# EAGLE design RGBKeyboard (EAGLE 9.3.0)

## Sheet 1 of 2
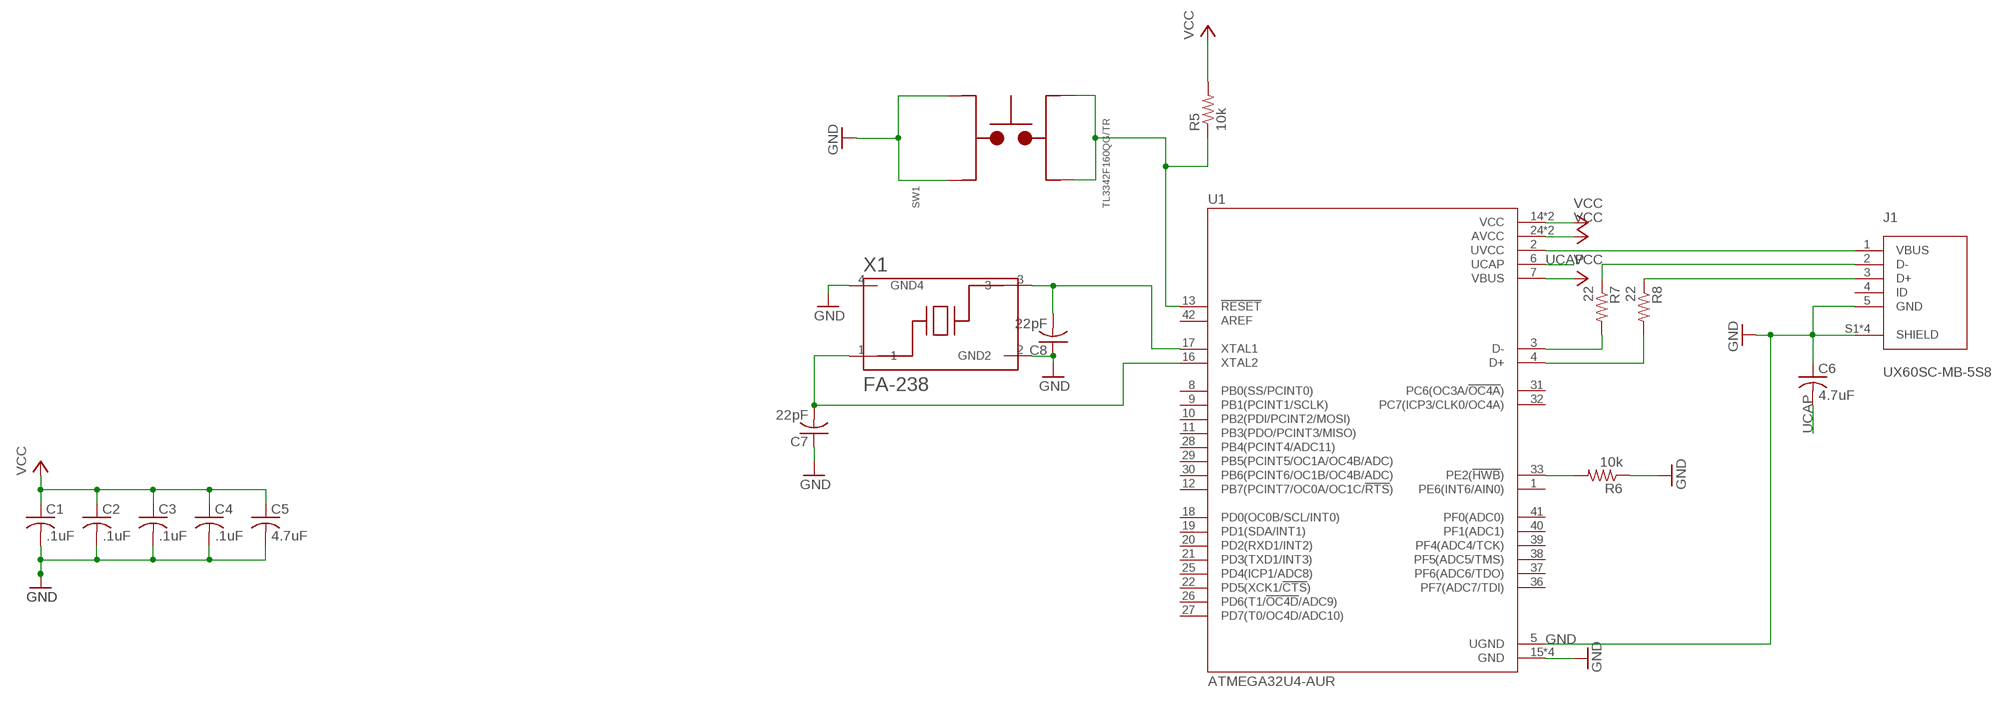
[diagram p0: schematic, sheet 1]

### Parts
C1  .1uF  C-USC0805  [C0805]
C2  .1uF  C-USC0805  [C0805]
C3  .1uF  C-USC0805  [C0805]
C4  .1uF  C-USC0805  [C0805]
C5  4.7uF  C-USC0805  [C0805]
C6  4.7uF  C-USC0805  [C0805]
C7  22pF  C-USC0805  [C0805]
C8  22pF  C-USC0805  [C0805]
J1  UX60SC-MB-5S8  [HIROSE_UX60SC-MB-5S8]
R5  10k  R-US_R0805  [R0805]
R6  10k  R-US_R0805  [R0805]
R7  22  R-US_R0805  [R0805]
R8  22  R-US_R0805  [R0805]
SW1  TL3342F160QG/TR  [SW_TL3342F160QG/TR]
U1  ATMEGA32U4-AUR  [QFP80P1200X1200X120-44N]
X1  FA-238  [OSCCC320X250X70-4N]

### Nets
GND: C1.2 C2.2 C3.2 C4.2 C5.2 C6.1 C7.1 C8.1 J1.5(GND) J1.S1(SHIELD) J1.S2(SHIELD) J1.S3(SHIELD) J1.S4(SHIELD) R6.1 SW1.3 SW1.4 U1.5(UGND) U1.15(GND) U1.23(GND) U1.35(GND) U1.43(GND) X1.2(GND2) X1.4(GND4)
N$7: C8.2 U1.17(XTAL1) X1.3
N$8: C7.2 U1.16(XTAL2) X1.1
N$9: R5.1 SW1.1 SW1.2 U1.13(!RESET)
N$10: R6.2 U1.33(PE2(!HWB!))
N$13: J1.1(VBUS) U1.2(UVCC)
N$14: R7.2 U1.3(D-)
N$15: J1.2(D-) R7.1
N$16: R8.2 U1.4(D+)
N$17: J1.3(D+) R8.1
UCAP: C6.2 U1.6(UCAP)
VCC: C1.1 C2.1 C3.1 C4.1 C5.1 R5.2 U1.7(VBUS) U1.14(VCC) U1.24(AVCC) U1.34(VCC) U1.44(AVCC)
Unconnected: J1.4(ID) U1.1(PE6(INT6/AIN0)) U1.8(PB0(SS/PCINT0)) U1.9(PB1(PCINT1/SCLK)) U1.10(PB2(PDI/PCINT2/MOSI)) U1.11(PB3(PDO/PCINT3/MISO)) U1.12(PB7(PCINT7/OC0A/OC1C/!RTS!)) U1.18(PD0(OC0B/SCL/INT0)) U1.19(PD1(SDA/INT1)) U1.20(PD2(RXD1/INT2)) U1.21(PD3(TXD1/INT3)) U1.22(PD5(XCK1/!CTS!)) U1.25(PD4(ICP1/ADC8)) U1.26(PD6(T1/!OC4D!/ADC9)) U1.27(PD7(T0/OC4D/ADC10)) U1.28(PB4(PCINT4/ADC11)) U1.29(PB5(PCINT5/OC1A/OC4B/ADC)) U1.30(PB6(PCINT6/OC1B/OC4B/ADC)) U1.31(PC6(OC3A/!OC4A!)) U1.32(PC7(ICP3/CLK0/OC4A)) U1.36(PF7(ADC7/TDI)) U1.37(PF6(ADC6/TDO)) U1.38(PF5(ADC5/TMS)) U1.39(PF4(ADC4/TCK)) U1.40(PF1(ADC1)) U1.41(PF0(ADC0)) U1.42(AREF)

## Sheet 2 of 2
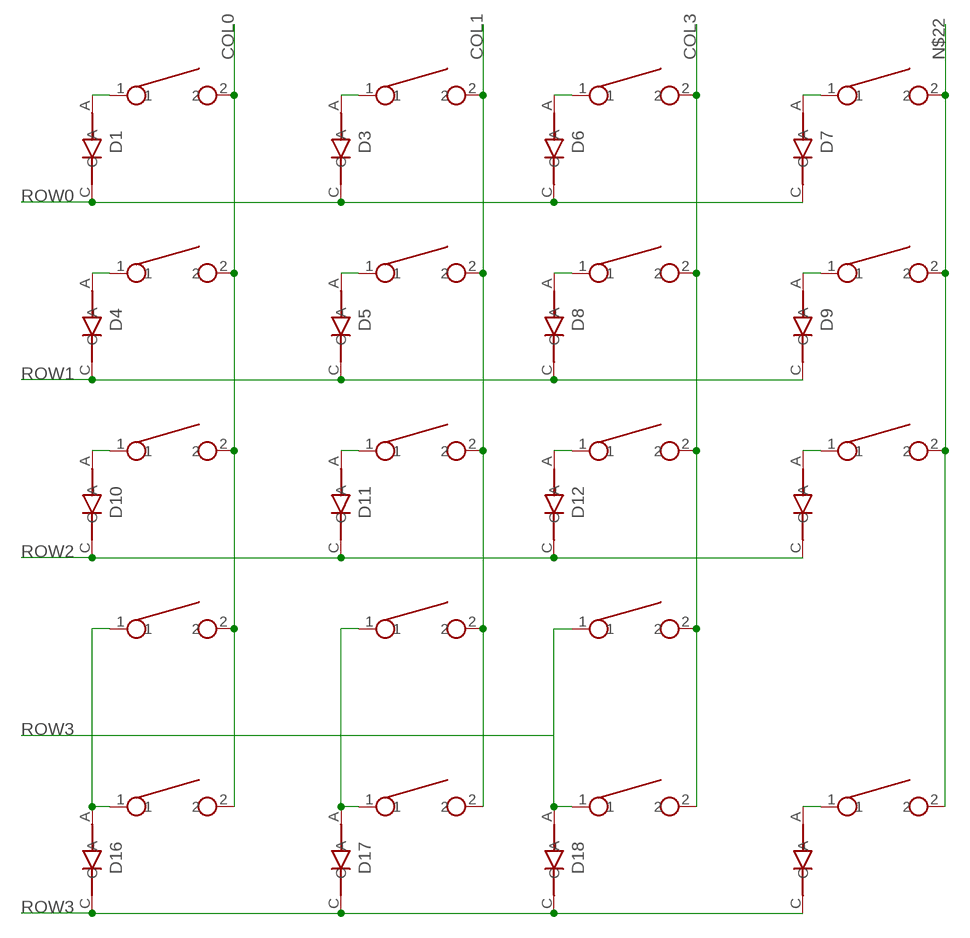
[diagram p1: schematic, sheet 2]

### Parts
D1  BAV21W-7-F  [SOD3715X135N]
D3  BAV21W-7-F  [SOD3715X135N]
D4  BAV21W-7-F  [SOD3715X135N]
D5  BAV21W-7-F  [SOD3715X135N]
D6  BAV21W-7-F  [SOD3715X135N]
D7  BAV21W-7-F  [SOD3715X135N]
D8  BAV21W-7-F  [SOD3715X135N]
D9  BAV21W-7-F  [SOD3715X135N]
D10  BAV21W-7-F  [SOD3715X135N]
D11  BAV21W-7-F  [SOD3715X135N]
D12  BAV21W-7-F  [SOD3715X135N]
D13  BAV21W-7-F  [SOD3715X135N]
D16  BAV21W-7-F  [SOD3715X135N]
D17  BAV21W-7-F  [SOD3715X135N]
D18  BAV21W-7-F  [SOD3715X135N]
D19  BAV21W-7-F  [SOD3715X135N]
U$1  CHERRY_MX  [CHERRY_MX]
U$2  CHERRY_MX  [CHERRY_MX]
U$3  CHERRY_MX  [CHERRY_MX]
U$4  CHERRY_MX  [CHERRY_MX]
U$5  CHERRY_MX  [CHERRY_MX]
U$6  CHERRY_MX  [CHERRY_MX]
U$7  CHERRY_MX  [CHERRY_MX]
U$8  CHERRY_MX  [CHERRY_MX]
U$9  CHERRY_MX  [CHERRY_MX]
U$10  CHERRY_MX  [CHERRY_MX]
U$11  CHERRY_MX  [CHERRY_MX]
U$12  CHERRY_MX  [CHERRY_MX]
U$13  CHERRY_MXCHERRY_MX_1_2  [CHERRY_MX_1_2]
U$14  CHERRY_MXCHERRY_MX_1_2  [CHERRY_MX_1_2]
U$15  CHERRY_MXCHERRY_MX_1_2  [CHERRY_MX_1_2]
U$16  CHERRY_MX  [CHERRY_MX]
U$17  CHERRY_MX  [CHERRY_MX]
U$18  CHERRY_MX  [CHERRY_MX]
U$19  CHERRY_MX  [CHERRY_MX]

### Nets
COL0: U$1.2 U$2.2 U$3.2 U$13.2 U$17.2
COL1: U$4.2 U$5.2 U$6.2 U$14.2 U$18.2
COL3: U$7.2 U$8.2 U$9.2 U$15.2 U$19.2
N$1: D9.A U$10.1
N$2: D5.A U$5.1
N$3: D7.A U$12.1
N$6: D3.A U$4.1
N$11: D11.A U$6.1
N$12: D13.A U$11.1
N$18: D17.A U$14.1 U$18.1
N$19: D19.A U$16.1
N$20: D16.A U$13.1 U$17.1
N$21: D18.A U$15.1 U$19.1
N$22: U$10.2 U$11.2 U$12.2 U$16.2
N$33: D6.A U$7.1
N$35: D8.A U$8.1
N$36: D12.A U$9.1
N$37: D10.A U$3.1
N$38: D1.A U$1.1
N$39: D4.A U$2.1
ROW0: D1.C D3.C D6.C D7.C
ROW1: D4.C D5.C D8.C D9.C
ROW2: D10.C D11.C D12.C D13.C
ROW3: D16.C D17.C D18.C D19.C

## Library data of the parts
C1-C8 = rcl:C-US: CAPACITOR, American symbol; SPICEPREFIX: C
D1 D3-D13 D16-D19 = BAV21W-7-F:BAV21W-7-F: SURFACE MOUNT SWITCHING DIODE; DESCRIPTION: DIODE, SWITCH, 200V, 0.25W, SOD123; Diode Type: Switching; Forward Current If_AV_; DIGI-KEY_PART_NUMBER: BAV21W-FDICT-ND; DIGI-KEY_PURCHASE_URL: https://www.digikey.com/product-detail/en/diodes-incorporated/BAV21W-7-F/BAV21W-FDICT-ND/717830?utm_source=snapeda&utm_medium=aggregator&utm_campaign=symbol; MF: Diodes Inc.; MP: BAV21W-7-F; PACKAGE: SOD-123 Diodes Inc.
J1 = UX60SC-MB-5S8:UX60SC-MB-5S8: Conn Mini USB 2.0 Type B RCP 5 POS 0.8mm Solder RA SMD 5 Terminal 1 Port Embossed T/R; AVAILABILITY: Unavailable; DESCRIPTION: Conn Mini USB 2.0 Type B RCP 5 POS 0.8mm Solder RA SMD 5 Terminal 1 Port Embossed T/R; MF: Hirose; MP: UX60SC-MB-5S8; PACKAGE: None; PRICE: None
R5-R8 = rcl:R-US_: RESISTOR, American symbol; SPICEPREFIX: R
SW1 = TL3342F160QG_TR:TL3342F160QG/TR: TL3342 Series SPST 1.6 N Round Button Gull Wing Surface Mount Tactile Switch; AVAILABILITY: Unavailable; DESCRIPTION: Switch Tactile Spst-No 0.05a 12v; MF: E-Switch; MP: TL3342F160QG/TR; PACKAGE: FakePackage u; PRICE: None
U1 = ATMEGA32U4-AUR:ATMEGA32U4-AUR: ATmega Series 16 MHz 32 KB Flash 2.5 KB SRAM 8-Bit Microcontroller - TQFP-44; AVAILABILITY: Unavailable; DESCRIPTION: ATmega Series 16 MHz 32 KB Flash 2.5 KB SRAM 8-Bit Microcontroller - TQFP-44; MF: Microchip; MP: ATMEGA32U4-AUR; PACKAGE: TQFP-44 Microchip; PRICE: None
U$1-U$19 = CHERRY_MX:CHERRY_MX
X1 = FA-238:FA-238: Crystal 24.0000mhz 18pf Smd; AVAILABILITY: Unavailable; MF: EPSON; MP: FA-238; PACKAGE: SMD-4 Epson; PRICE: None

## Net classes
0 default: width 0.305 mm

## Board
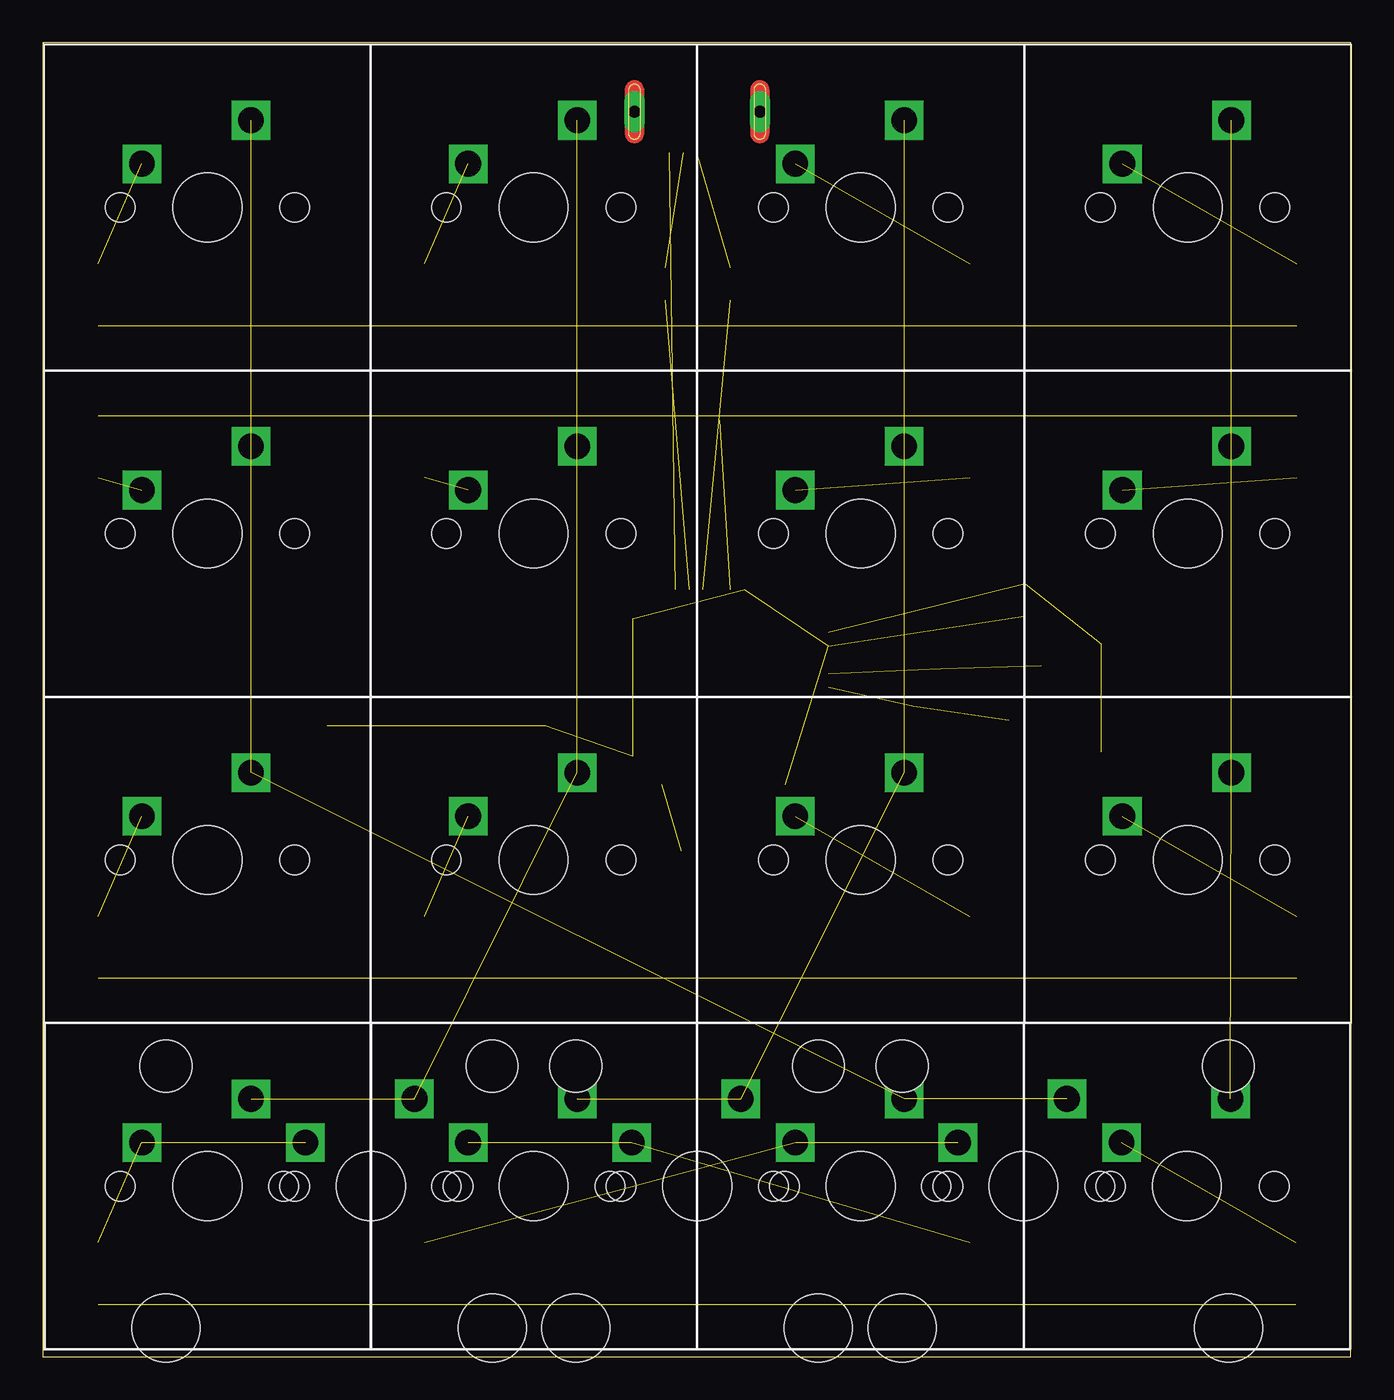
[diagram p2: board, top side]
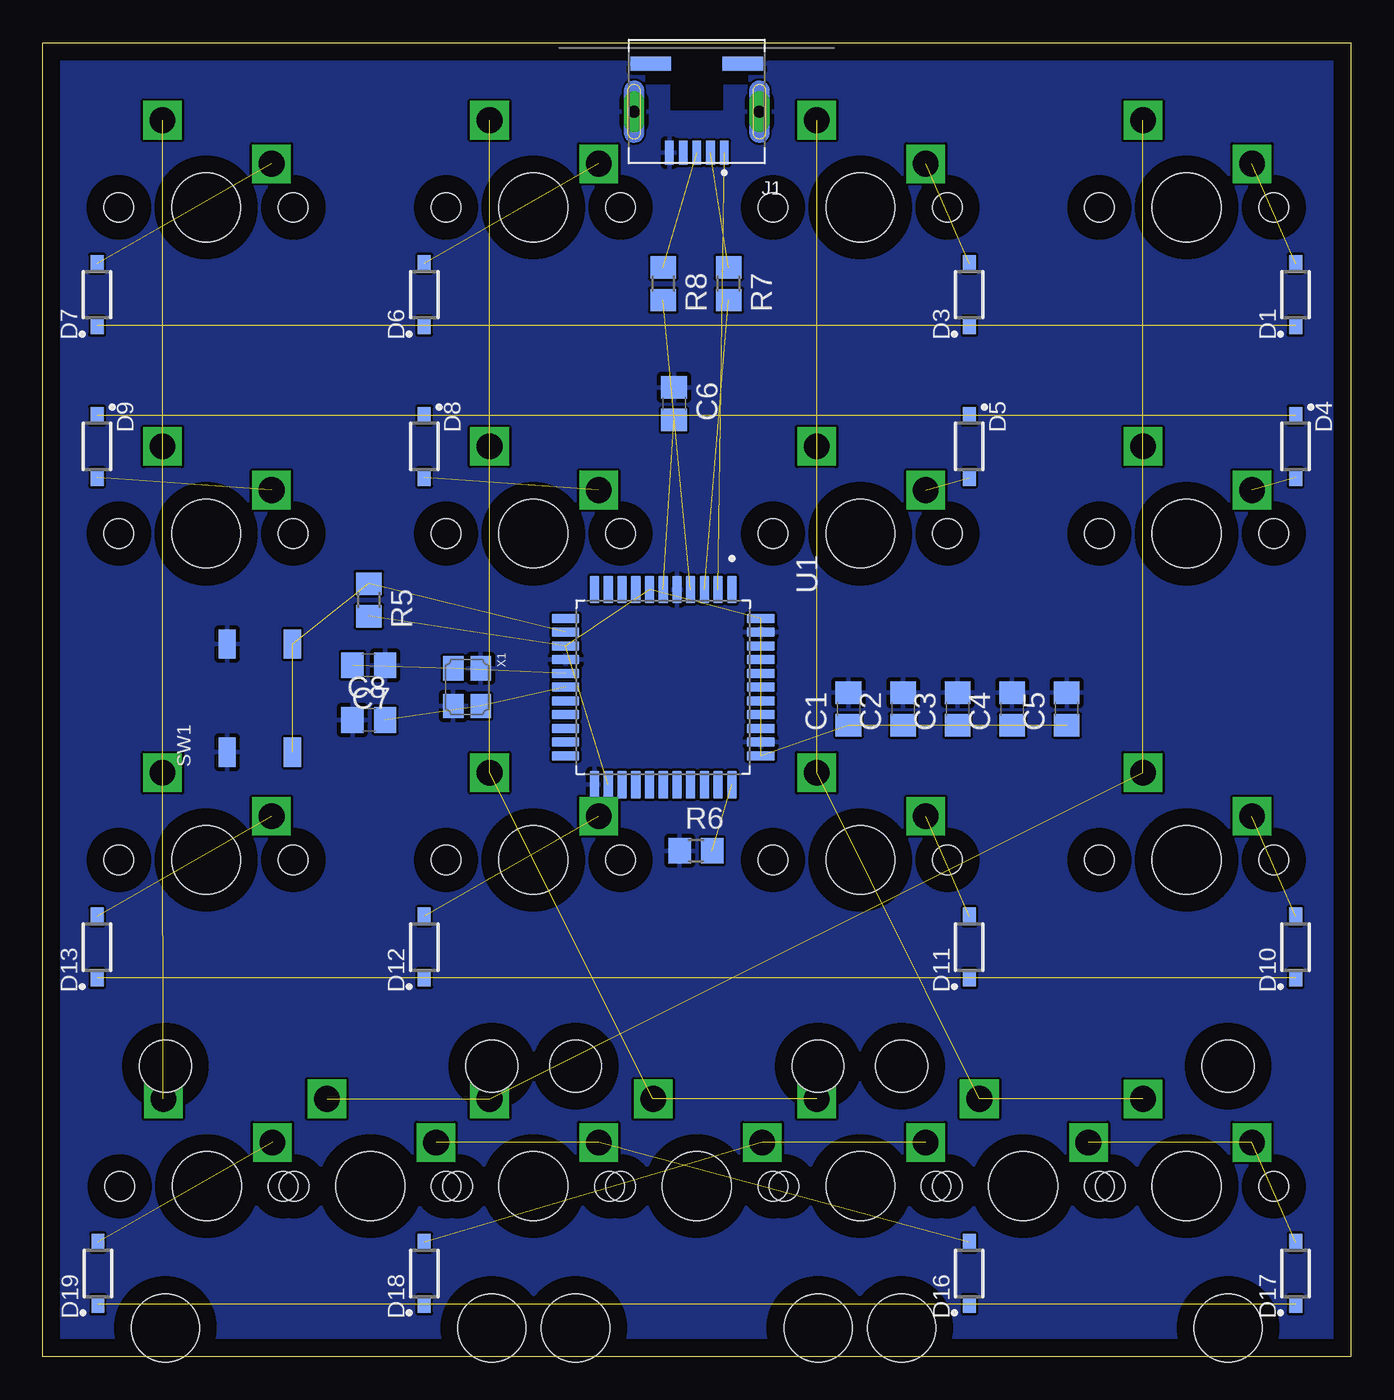
[diagram p3: board, bottom side, seen from below]

Size 76.18 x 76.5 mm. Coordinates in mm from the lower left corner, seen from the top.
Outline: 0,0 76.18,0 76.18,76.5 0,76.5 0,0
Copper layers (1*16): Top 0.035mm / dielectric 1.5mm / Bottom 0.035mm
Design rules "default": minimum track width 6mil, minimum drill 0.35mm, track to track 6mil, track to pad 6mil, pad to pad 6mil, via to via 6mil, smd to smd 6mil, copper to edge 40mil, drill to drill 6mil, minimum pad ring 10mil, minimum via ring 8mil, stop-mask expansion 4mil, vias tented up to drill 0mil, thermal gap 10mil

### Footprints (pad centres in the part's own frame; a part is rotated, then mirrored left to right if it is on the bottom)
C0805 = smd 1.3 x 1.5: 1 -0.95,0; 2 0.95,0
SOD3715X135N = smd 1 x 0.75: A 1.8,0; C -1.8,0
HIROSE_UX60SC-MB-5S8 = smd 0.5 x 1.4: 1 -1.6,6.1; 2 -0.8,6.1; 3 0,6.1; 4 0.8,6.1; 5 1.6,6.1 | drill 0.7 pad 1.1 long: S1 -3.65,3.7; S2 3.65,3.7 | smd 2.35 x 0.8: S3 -2.675,0.9; S4 2.675,0.9
R0805 = smd 1.3 x 1.5: 1 -0.95,0; 2 0.95,0
SW_TL3342F160QG/TR = smd 1.7 x 1: 1 -3.15,-1.9; 2 3.15,-1.9; 3 -3.15,1.9; 4 3.15,1.9
QFP80P1200X1200X120-44N = smd 1.6 x 0.55: 1 -5.68,4; 2 -5.68,3.2; 3 -5.68,2.4; 4 -5.68,1.6; 5 -5.68,0.8; 6 -5.68,0; 7 -5.68,-0.8; 8 -5.68,-1.6; 9 -5.68,-2.4; 10 -5.68,-3.2; 11 -5.68,-4; 23 5.68,-4; 24 5.68,-3.2; 25 5.68,-2.4; 26 5.68,-1.6; 27 5.68,-0.8; 28 5.68,0; 29 5.68,0.8; 30 5.68,1.6; 31 5.68,2.4; 32 5.68,3.2; 33 5.68,4 | smd 0.55 x 1.6: 12 -4,-5.68; 13 -3.2,-5.68; 14 -2.4,-5.68; 15 -1.6,-5.68; 16 -0.8,-5.68; 17 0,-5.68; 18 0.8,-5.68; 19 1.6,-5.68; 20 2.4,-5.68; 21 3.2,-5.68; 22 4,-5.68; 34 4,5.68; 35 3.2,5.68; 36 2.4,5.68; 37 1.6,5.68; 38 0.8,5.68; 39 0,5.68; 40 -0.8,5.68; 41 -1.6,5.68; 42 -2.4,5.68; 43 -3.2,5.68; 44 -4,5.68
CHERRY_MX = drill 1.499 square: 1 -3.81,2.54; 2 2.54,5.08 | hole 3.988: 0,0 | hole 1.702: -5.08,0; 5.08,0
CHERRY_MX_1_2 = drill 1.5 square: 1 -3.81,2.54; 2 2.54,5.08 | hole 4: 0,0 | hole 1.7: -5.08,0; 5.08,0 | hole 3: -11.938,6.985; 11.938,6.985 | hole 3.95: -11.938,-8.255; 11.938,-8.255
OSCCC320X250X70-4N = smd 1.4 x 1.2: 1 -1.1,-0.8; 2 1.1,-0.8; 3 1.1,0.8; 4 -1.1,0.8

### Placement (x,y rotation side)
C1  29.26,37.72 90 bottom
C2  26.09,37.72 90 bottom
C3  22.91,37.72 90 bottom
C4  19.73,37.72 90 bottom
C5  16.56,37.72 90 bottom
C6  39.42,55.49 270 bottom
C7  57.2,40.26 180 bottom
C8  57.2,37.08 0 bottom
D1  3.23,61.84 90 bottom
D3  22.23,61.84 90 bottom
D4  3.23,53.01 270 bottom
D5  22.23,53.01 270 bottom
D6  53.98,61.84 90 bottom
D7  73.03,61.84 90 bottom
D8  53.98,53.01 270 bottom
D9  73.03,53.01 270 bottom
D10  3.23,23.84 90 bottom
D11  22.23,23.84 90 bottom
D12  53.98,23.84 90 bottom
D13  73.03,23.84 90 bottom
D16  22.23,4.84 90 bottom
D17  3.23,4.84 90 bottom
D18  53.98,4.84 90 bottom
D19  72.97,4.84 90 bottom
J1  38.1,76.2 180 bottom
R5  57.2,44.06 270 bottom
R6  38.15,29.46 0 bottom
R7  36.24,62.48 270 bottom
R8  40.05,62.48 270 bottom
SW1  63.55,38.35 90 bottom
U1  40.05,38.98 270 bottom
U$1  9.57,66.92 0 top
U$2  9.57,47.92 0 top
U$3  9.57,28.93 0 top
U$4  28.57,66.92 0 top
U$5  28.57,47.92 0 top
U$6  28.57,28.93 0 top
U$7  47.62,66.92 0 top
U$8  47.62,47.92 0 top
U$9  47.62,28.93 0 top
U$10  66.67,47.92 0 top
U$11  66.67,28.93 0 top
U$12  66.67,66.92 0 top
U$13  57.1,9.93 0 top
U$14  19.1,9.93 0 top
U$15  38.1,9.93 0 top
U$16  66.62,9.93 0 top
U$17  47.62,9.93 0 top
U$18  9.57,9.93 0 top
U$19  28.57,9.93 0 top
X1  51.48,38.98 270 bottom

### Tracks (layer width: path | path; a pad name or v marks a point on that pad's centre or on a via)
COL0  (4 unrouted)
COL1  (4 unrouted)
COL3  (4 unrouted)
GND
  pour Bottom: -0.64,77.47 -0.64,-0.64 77.47,-0.64 77.47,77.47
N$1  (1 unrouted)
N$2  (1 unrouted)
N$3  (1 unrouted)
N$6  (1 unrouted)
N$7  (2 unrouted)
N$8  (2 unrouted)
N$9  (3 unrouted)
N$10  (1 unrouted)
N$11  (1 unrouted)
N$12  (1 unrouted)
N$13  (1 unrouted)
N$14  (1 unrouted)
N$15  (1 unrouted)
N$16  (1 unrouted)
N$17  (1 unrouted)
N$18  (2 unrouted)
N$19  (1 unrouted)
N$20  (2 unrouted)
N$21  (2 unrouted)
N$22  (3 unrouted)
N$33  (1 unrouted)
N$35  (1 unrouted)
N$36  (1 unrouted)
N$37  (1 unrouted)
N$38  (1 unrouted)
N$39  (1 unrouted)
ROW0  (3 unrouted)
ROW1  (3 unrouted)
ROW2  (3 unrouted)
ROW3  (3 unrouted)
UCAP  (1 unrouted)
VCC  (10 unrouted)